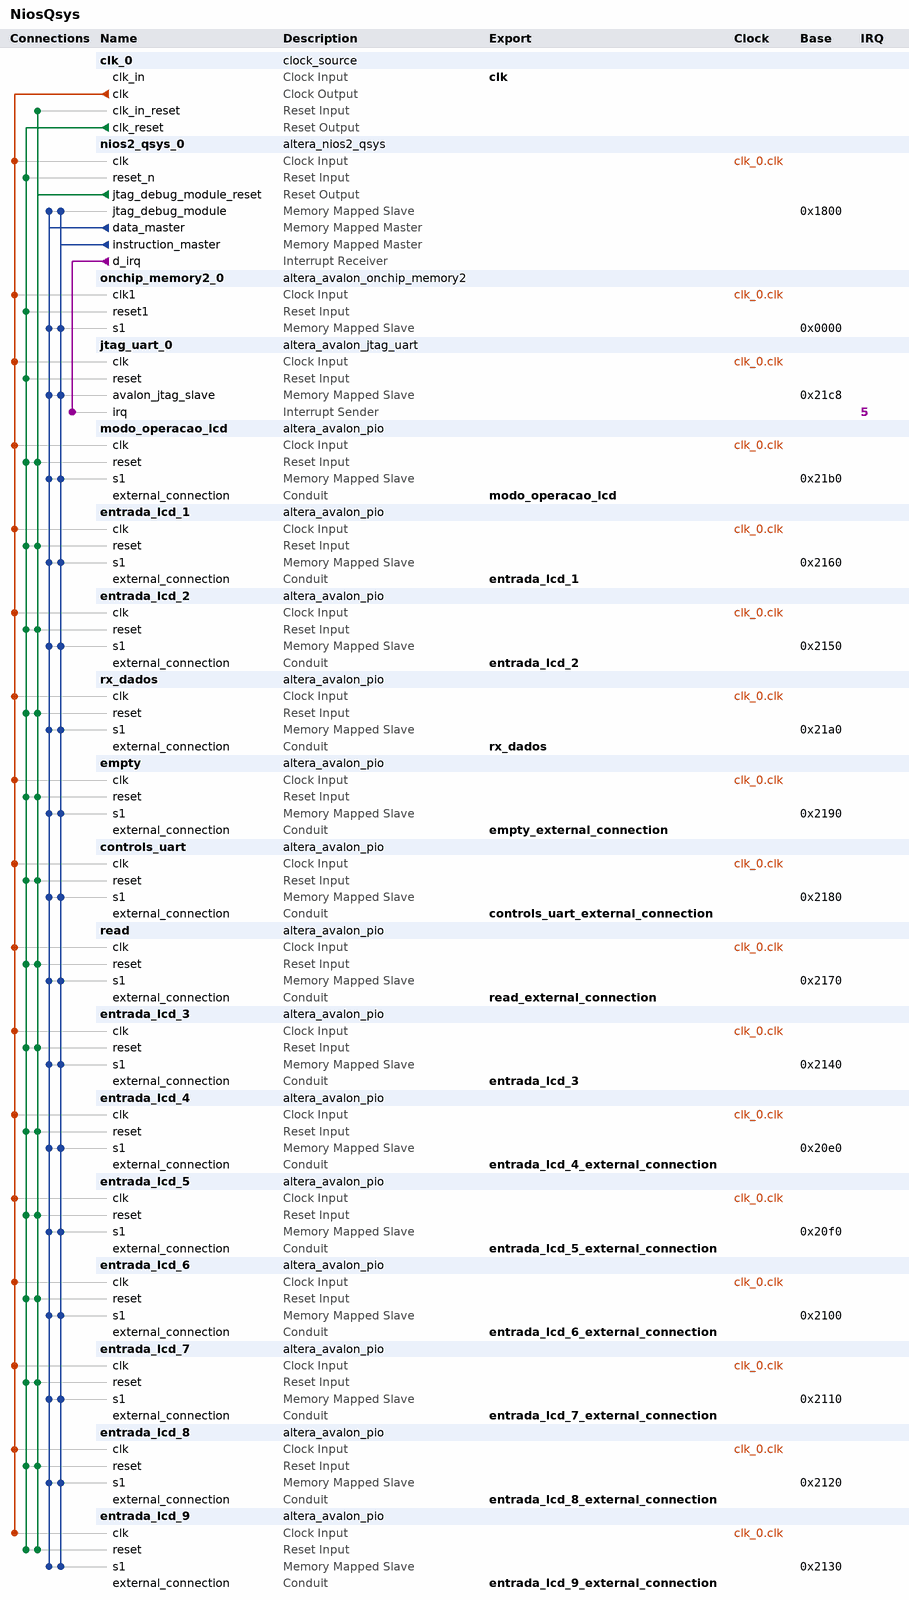
[diagram p0: system contents]
# Platform Designer (Qsys) system NiosQsys, Cyclone IV E EP4CE6E22C8
# Parameters at their usual value, and those the tool derives, are not listed.
package require -exact qsys 13.0.1.99.2
create_system NiosQsys
set_project_property DEVICE_FAMILY {Cyclone IV E}
set_project_property DEVICE EP4CE6E22C8

add_instance clk_0 clock_source 13.0
set_instance_parameter_value clk_0 clockFrequency 50000000

add_instance nios2_qsys_0 altera_nios2_qsys 13.0
set_instance_parameter_value nios2_qsys_0 resetSlave onchip_memory2_0.s1
set_instance_parameter_value nios2_qsys_0 mmu_TLBMissExcSlave None
set_instance_parameter_value nios2_qsys_0 exceptionSlave onchip_memory2_0.s1
set_instance_parameter_value nios2_qsys_0 breakSlave nios2_qsys_0.jtag_debug_module
set_instance_parameter_value nios2_qsys_0 impl Tiny
set_instance_parameter_value nios2_qsys_0 icache_size 4096

add_instance onchip_memory2_0 altera_avalon_onchip_memory2 13.0.1.99.2
set_instance_parameter_value onchip_memory2_0 dataWidth 32
set_instance_parameter_value onchip_memory2_0 dualPort false
set_instance_parameter_value onchip_memory2_0 initMemContent true
set_instance_parameter_value onchip_memory2_0 initializationFileName "C:\\Users\\nady_\\Desktop\\ProjetoProcessadorQuartus\\onchip_mem.hex"
set_instance_parameter_value onchip_memory2_0 memorySize 4096
set_instance_parameter_value onchip_memory2_0 useNonDefaultInitFile true

add_instance jtag_uart_0 altera_avalon_jtag_uart 13.0.1.99.2
set_instance_parameter_value jtag_uart_0 simInteractiveOptions NO_INTERACTIVE_WINDOWS

add_instance modo_operacao_lcd altera_avalon_pio 13.0.1.99.2
set_instance_parameter_value modo_operacao_lcd direction Output
set_instance_parameter_value modo_operacao_lcd width 2

add_instance entrada_lcd_1 altera_avalon_pio 13.0.1.99.2
set_instance_parameter_value entrada_lcd_1 direction Output
set_instance_parameter_value entrada_lcd_1 width 8

add_instance entrada_lcd_2 altera_avalon_pio 13.0.1.99.2
set_instance_parameter_value entrada_lcd_2 direction Output
set_instance_parameter_value entrada_lcd_2 width 8

add_instance rx_dados altera_avalon_pio 13.0.1.99.2
set_instance_parameter_value rx_dados captureEdge true
set_instance_parameter_value rx_dados direction Input
set_instance_parameter_value rx_dados width 8

add_instance empty altera_avalon_pio 13.0.1.99.2
set_instance_parameter_value empty direction Input
set_instance_parameter_value empty width 1

add_instance controls_uart altera_avalon_pio 13.0.1.99.2
set_instance_parameter_value controls_uart direction Output
set_instance_parameter_value controls_uart width 8

add_instance read altera_avalon_pio 13.0.1.99.2
set_instance_parameter_value read direction Output
set_instance_parameter_value read width 1

add_instance entrada_lcd_3 altera_avalon_pio 13.0.1.99.2
set_instance_parameter_value entrada_lcd_3 direction Output
set_instance_parameter_value entrada_lcd_3 width 8

add_instance entrada_lcd_4 altera_avalon_pio 13.0.1.99.2
set_instance_parameter_value entrada_lcd_4 direction Output
set_instance_parameter_value entrada_lcd_4 width 8

add_instance entrada_lcd_5 altera_avalon_pio 13.0.1.99.2
set_instance_parameter_value entrada_lcd_5 direction Output
set_instance_parameter_value entrada_lcd_5 width 8

add_instance entrada_lcd_6 altera_avalon_pio 13.0.1.99.2
set_instance_parameter_value entrada_lcd_6 direction Output
set_instance_parameter_value entrada_lcd_6 width 8

add_instance entrada_lcd_7 altera_avalon_pio 13.0.1.99.2
set_instance_parameter_value entrada_lcd_7 direction Output
set_instance_parameter_value entrada_lcd_7 width 8

add_instance entrada_lcd_8 altera_avalon_pio 13.0.1.99.2
set_instance_parameter_value entrada_lcd_8 direction Output
set_instance_parameter_value entrada_lcd_8 width 8

add_instance entrada_lcd_9 altera_avalon_pio 13.0.1.99.2
set_instance_parameter_value entrada_lcd_9 direction Output
set_instance_parameter_value entrada_lcd_9 width 8

# connections
add_connection clk_0.clk controls_uart.clk clock
add_connection clk_0.clk empty.clk clock
add_connection clk_0.clk entrada_lcd_1.clk clock
add_connection clk_0.clk entrada_lcd_2.clk clock
add_connection clk_0.clk entrada_lcd_3.clk clock
add_connection clk_0.clk entrada_lcd_4.clk clock
add_connection clk_0.clk entrada_lcd_5.clk clock
add_connection clk_0.clk entrada_lcd_6.clk clock
add_connection clk_0.clk entrada_lcd_7.clk clock
add_connection clk_0.clk entrada_lcd_8.clk clock
add_connection clk_0.clk entrada_lcd_9.clk clock
add_connection clk_0.clk jtag_uart_0.clk clock
add_connection clk_0.clk modo_operacao_lcd.clk clock
add_connection clk_0.clk nios2_qsys_0.clk clock
add_connection clk_0.clk onchip_memory2_0.clk1 clock
add_connection clk_0.clk read.clk clock
add_connection clk_0.clk rx_dados.clk clock
add_connection clk_0.clk_reset controls_uart.reset reset
add_connection clk_0.clk_reset empty.reset reset
add_connection clk_0.clk_reset entrada_lcd_1.reset reset
add_connection clk_0.clk_reset entrada_lcd_2.reset reset
add_connection clk_0.clk_reset entrada_lcd_3.reset reset
add_connection clk_0.clk_reset entrada_lcd_4.reset reset
add_connection clk_0.clk_reset entrada_lcd_5.reset reset
add_connection clk_0.clk_reset entrada_lcd_6.reset reset
add_connection clk_0.clk_reset entrada_lcd_7.reset reset
add_connection clk_0.clk_reset entrada_lcd_8.reset reset
add_connection clk_0.clk_reset entrada_lcd_9.reset reset
add_connection clk_0.clk_reset jtag_uart_0.reset reset
add_connection clk_0.clk_reset modo_operacao_lcd.reset reset
add_connection clk_0.clk_reset nios2_qsys_0.reset_n reset
add_connection clk_0.clk_reset onchip_memory2_0.reset1 reset
add_connection clk_0.clk_reset read.reset reset
add_connection clk_0.clk_reset rx_dados.reset reset
add_connection nios2_qsys_0.jtag_debug_module_reset clk_0.clk_in_reset reset
add_connection nios2_qsys_0.jtag_debug_module_reset controls_uart.reset reset
add_connection nios2_qsys_0.jtag_debug_module_reset empty.reset reset
add_connection nios2_qsys_0.jtag_debug_module_reset entrada_lcd_1.reset reset
add_connection nios2_qsys_0.jtag_debug_module_reset entrada_lcd_2.reset reset
add_connection nios2_qsys_0.jtag_debug_module_reset entrada_lcd_3.reset reset
add_connection nios2_qsys_0.jtag_debug_module_reset entrada_lcd_4.reset reset
add_connection nios2_qsys_0.jtag_debug_module_reset entrada_lcd_5.reset reset
add_connection nios2_qsys_0.jtag_debug_module_reset entrada_lcd_6.reset reset
add_connection nios2_qsys_0.jtag_debug_module_reset entrada_lcd_7.reset reset
add_connection nios2_qsys_0.jtag_debug_module_reset entrada_lcd_8.reset reset
add_connection nios2_qsys_0.jtag_debug_module_reset entrada_lcd_9.reset reset
add_connection nios2_qsys_0.jtag_debug_module_reset modo_operacao_lcd.reset reset
add_connection nios2_qsys_0.jtag_debug_module_reset read.reset reset
add_connection nios2_qsys_0.jtag_debug_module_reset rx_dados.reset reset
add_connection nios2_qsys_0.data_master controls_uart.s1 avalon
set_connection_parameter_value nios2_qsys_0.data_master/controls_uart.s1 baseAddress 0x2180
add_connection nios2_qsys_0.data_master empty.s1 avalon
set_connection_parameter_value nios2_qsys_0.data_master/empty.s1 baseAddress 0x2190
add_connection nios2_qsys_0.data_master entrada_lcd_1.s1 avalon
set_connection_parameter_value nios2_qsys_0.data_master/entrada_lcd_1.s1 baseAddress 0x2160
add_connection nios2_qsys_0.data_master entrada_lcd_2.s1 avalon
set_connection_parameter_value nios2_qsys_0.data_master/entrada_lcd_2.s1 baseAddress 0x2150
add_connection nios2_qsys_0.data_master entrada_lcd_3.s1 avalon
set_connection_parameter_value nios2_qsys_0.data_master/entrada_lcd_3.s1 baseAddress 0x2140
add_connection nios2_qsys_0.data_master entrada_lcd_4.s1 avalon
set_connection_parameter_value nios2_qsys_0.data_master/entrada_lcd_4.s1 baseAddress 0x20e0
add_connection nios2_qsys_0.data_master entrada_lcd_5.s1 avalon
set_connection_parameter_value nios2_qsys_0.data_master/entrada_lcd_5.s1 baseAddress 0x20f0
add_connection nios2_qsys_0.data_master entrada_lcd_6.s1 avalon
set_connection_parameter_value nios2_qsys_0.data_master/entrada_lcd_6.s1 baseAddress 0x2100
add_connection nios2_qsys_0.data_master entrada_lcd_7.s1 avalon
set_connection_parameter_value nios2_qsys_0.data_master/entrada_lcd_7.s1 baseAddress 0x2110
add_connection nios2_qsys_0.data_master entrada_lcd_8.s1 avalon
set_connection_parameter_value nios2_qsys_0.data_master/entrada_lcd_8.s1 baseAddress 0x2120
add_connection nios2_qsys_0.data_master entrada_lcd_9.s1 avalon
set_connection_parameter_value nios2_qsys_0.data_master/entrada_lcd_9.s1 baseAddress 0x2130
add_connection nios2_qsys_0.data_master jtag_uart_0.avalon_jtag_slave avalon
set_connection_parameter_value nios2_qsys_0.data_master/jtag_uart_0.avalon_jtag_slave baseAddress 0x21c8
add_connection nios2_qsys_0.data_master modo_operacao_lcd.s1 avalon
set_connection_parameter_value nios2_qsys_0.data_master/modo_operacao_lcd.s1 baseAddress 0x21b0
add_connection nios2_qsys_0.data_master nios2_qsys_0.jtag_debug_module avalon
set_connection_parameter_value nios2_qsys_0.data_master/nios2_qsys_0.jtag_debug_module baseAddress 0x1800
add_connection nios2_qsys_0.data_master onchip_memory2_0.s1 avalon
set_connection_parameter_value nios2_qsys_0.data_master/onchip_memory2_0.s1 baseAddress 0x0000
add_connection nios2_qsys_0.data_master read.s1 avalon
set_connection_parameter_value nios2_qsys_0.data_master/read.s1 baseAddress 0x2170
add_connection nios2_qsys_0.data_master rx_dados.s1 avalon
set_connection_parameter_value nios2_qsys_0.data_master/rx_dados.s1 baseAddress 0x21a0
add_connection nios2_qsys_0.instruction_master controls_uart.s1 avalon
set_connection_parameter_value nios2_qsys_0.instruction_master/controls_uart.s1 baseAddress 0x2180
add_connection nios2_qsys_0.instruction_master empty.s1 avalon
set_connection_parameter_value nios2_qsys_0.instruction_master/empty.s1 baseAddress 0x2190
add_connection nios2_qsys_0.instruction_master entrada_lcd_1.s1 avalon
set_connection_parameter_value nios2_qsys_0.instruction_master/entrada_lcd_1.s1 baseAddress 0x2160
add_connection nios2_qsys_0.instruction_master entrada_lcd_2.s1 avalon
set_connection_parameter_value nios2_qsys_0.instruction_master/entrada_lcd_2.s1 baseAddress 0x2150
add_connection nios2_qsys_0.instruction_master entrada_lcd_3.s1 avalon
set_connection_parameter_value nios2_qsys_0.instruction_master/entrada_lcd_3.s1 baseAddress 0x2140
add_connection nios2_qsys_0.instruction_master entrada_lcd_4.s1 avalon
set_connection_parameter_value nios2_qsys_0.instruction_master/entrada_lcd_4.s1 baseAddress 0x20e0
add_connection nios2_qsys_0.instruction_master entrada_lcd_5.s1 avalon
set_connection_parameter_value nios2_qsys_0.instruction_master/entrada_lcd_5.s1 baseAddress 0x20f0
add_connection nios2_qsys_0.instruction_master entrada_lcd_6.s1 avalon
set_connection_parameter_value nios2_qsys_0.instruction_master/entrada_lcd_6.s1 baseAddress 0x2100
add_connection nios2_qsys_0.instruction_master entrada_lcd_7.s1 avalon
set_connection_parameter_value nios2_qsys_0.instruction_master/entrada_lcd_7.s1 baseAddress 0x2110
add_connection nios2_qsys_0.instruction_master entrada_lcd_8.s1 avalon
set_connection_parameter_value nios2_qsys_0.instruction_master/entrada_lcd_8.s1 baseAddress 0x2120
add_connection nios2_qsys_0.instruction_master entrada_lcd_9.s1 avalon
set_connection_parameter_value nios2_qsys_0.instruction_master/entrada_lcd_9.s1 baseAddress 0x2130
add_connection nios2_qsys_0.instruction_master jtag_uart_0.avalon_jtag_slave avalon
set_connection_parameter_value nios2_qsys_0.instruction_master/jtag_uart_0.avalon_jtag_slave baseAddress 0x21c8
add_connection nios2_qsys_0.instruction_master modo_operacao_lcd.s1 avalon
set_connection_parameter_value nios2_qsys_0.instruction_master/modo_operacao_lcd.s1 baseAddress 0x21b0
add_connection nios2_qsys_0.instruction_master nios2_qsys_0.jtag_debug_module avalon
set_connection_parameter_value nios2_qsys_0.instruction_master/nios2_qsys_0.jtag_debug_module baseAddress 0x1800
add_connection nios2_qsys_0.instruction_master onchip_memory2_0.s1 avalon
set_connection_parameter_value nios2_qsys_0.instruction_master/onchip_memory2_0.s1 baseAddress 0x0000
add_connection nios2_qsys_0.instruction_master read.s1 avalon
set_connection_parameter_value nios2_qsys_0.instruction_master/read.s1 baseAddress 0x2170
add_connection nios2_qsys_0.instruction_master rx_dados.s1 avalon
set_connection_parameter_value nios2_qsys_0.instruction_master/rx_dados.s1 baseAddress 0x21a0
add_connection nios2_qsys_0.d_irq jtag_uart_0.irq interrupt
set_connection_parameter_value nios2_qsys_0.d_irq/jtag_uart_0.irq irqNumber 5

# exported interfaces
add_interface clk clock sink
set_interface_property clk EXPORT_OF clk_0.clk_in
add_interface modo_operacao_lcd conduit end
set_interface_property modo_operacao_lcd EXPORT_OF modo_operacao_lcd.external_connection
add_interface rx_dados conduit end
set_interface_property rx_dados EXPORT_OF rx_dados.external_connection
add_interface empty_external_connection conduit end
set_interface_property empty_external_connection EXPORT_OF empty.external_connection
add_interface controls_uart_external_connection conduit end
set_interface_property controls_uart_external_connection EXPORT_OF controls_uart.external_connection
add_interface read_external_connection conduit end
set_interface_property read_external_connection EXPORT_OF read.external_connection
add_interface entrada_lcd_2 conduit end
set_interface_property entrada_lcd_2 EXPORT_OF entrada_lcd_2.external_connection
add_interface entrada_lcd_1 conduit end
set_interface_property entrada_lcd_1 EXPORT_OF entrada_lcd_1.external_connection
add_interface entrada_lcd_3 conduit end
set_interface_property entrada_lcd_3 EXPORT_OF entrada_lcd_3.external_connection
add_interface entrada_lcd_4_external_connection conduit end
set_interface_property entrada_lcd_4_external_connection EXPORT_OF entrada_lcd_4.external_connection
add_interface entrada_lcd_5_external_connection conduit end
set_interface_property entrada_lcd_5_external_connection EXPORT_OF entrada_lcd_5.external_connection
add_interface entrada_lcd_6_external_connection conduit end
set_interface_property entrada_lcd_6_external_connection EXPORT_OF entrada_lcd_6.external_connection
add_interface entrada_lcd_7_external_connection conduit end
set_interface_property entrada_lcd_7_external_connection EXPORT_OF entrada_lcd_7.external_connection
add_interface entrada_lcd_8_external_connection conduit end
set_interface_property entrada_lcd_8_external_connection EXPORT_OF entrada_lcd_8.external_connection
add_interface entrada_lcd_9_external_connection conduit end
set_interface_property entrada_lcd_9_external_connection EXPORT_OF entrada_lcd_9.external_connection

set_interconnect_requirement {$system} qsys_mm.clockCrossingAdapter HANDSHAKE
set_interconnect_requirement {$system} qsys_mm.maxAdditionalLatency 1

save_system NiosQsys.qsys
